# Altium schematic sheet MCU.SchDoc
size B; SheetNumber: 1; SheetTotal: 7
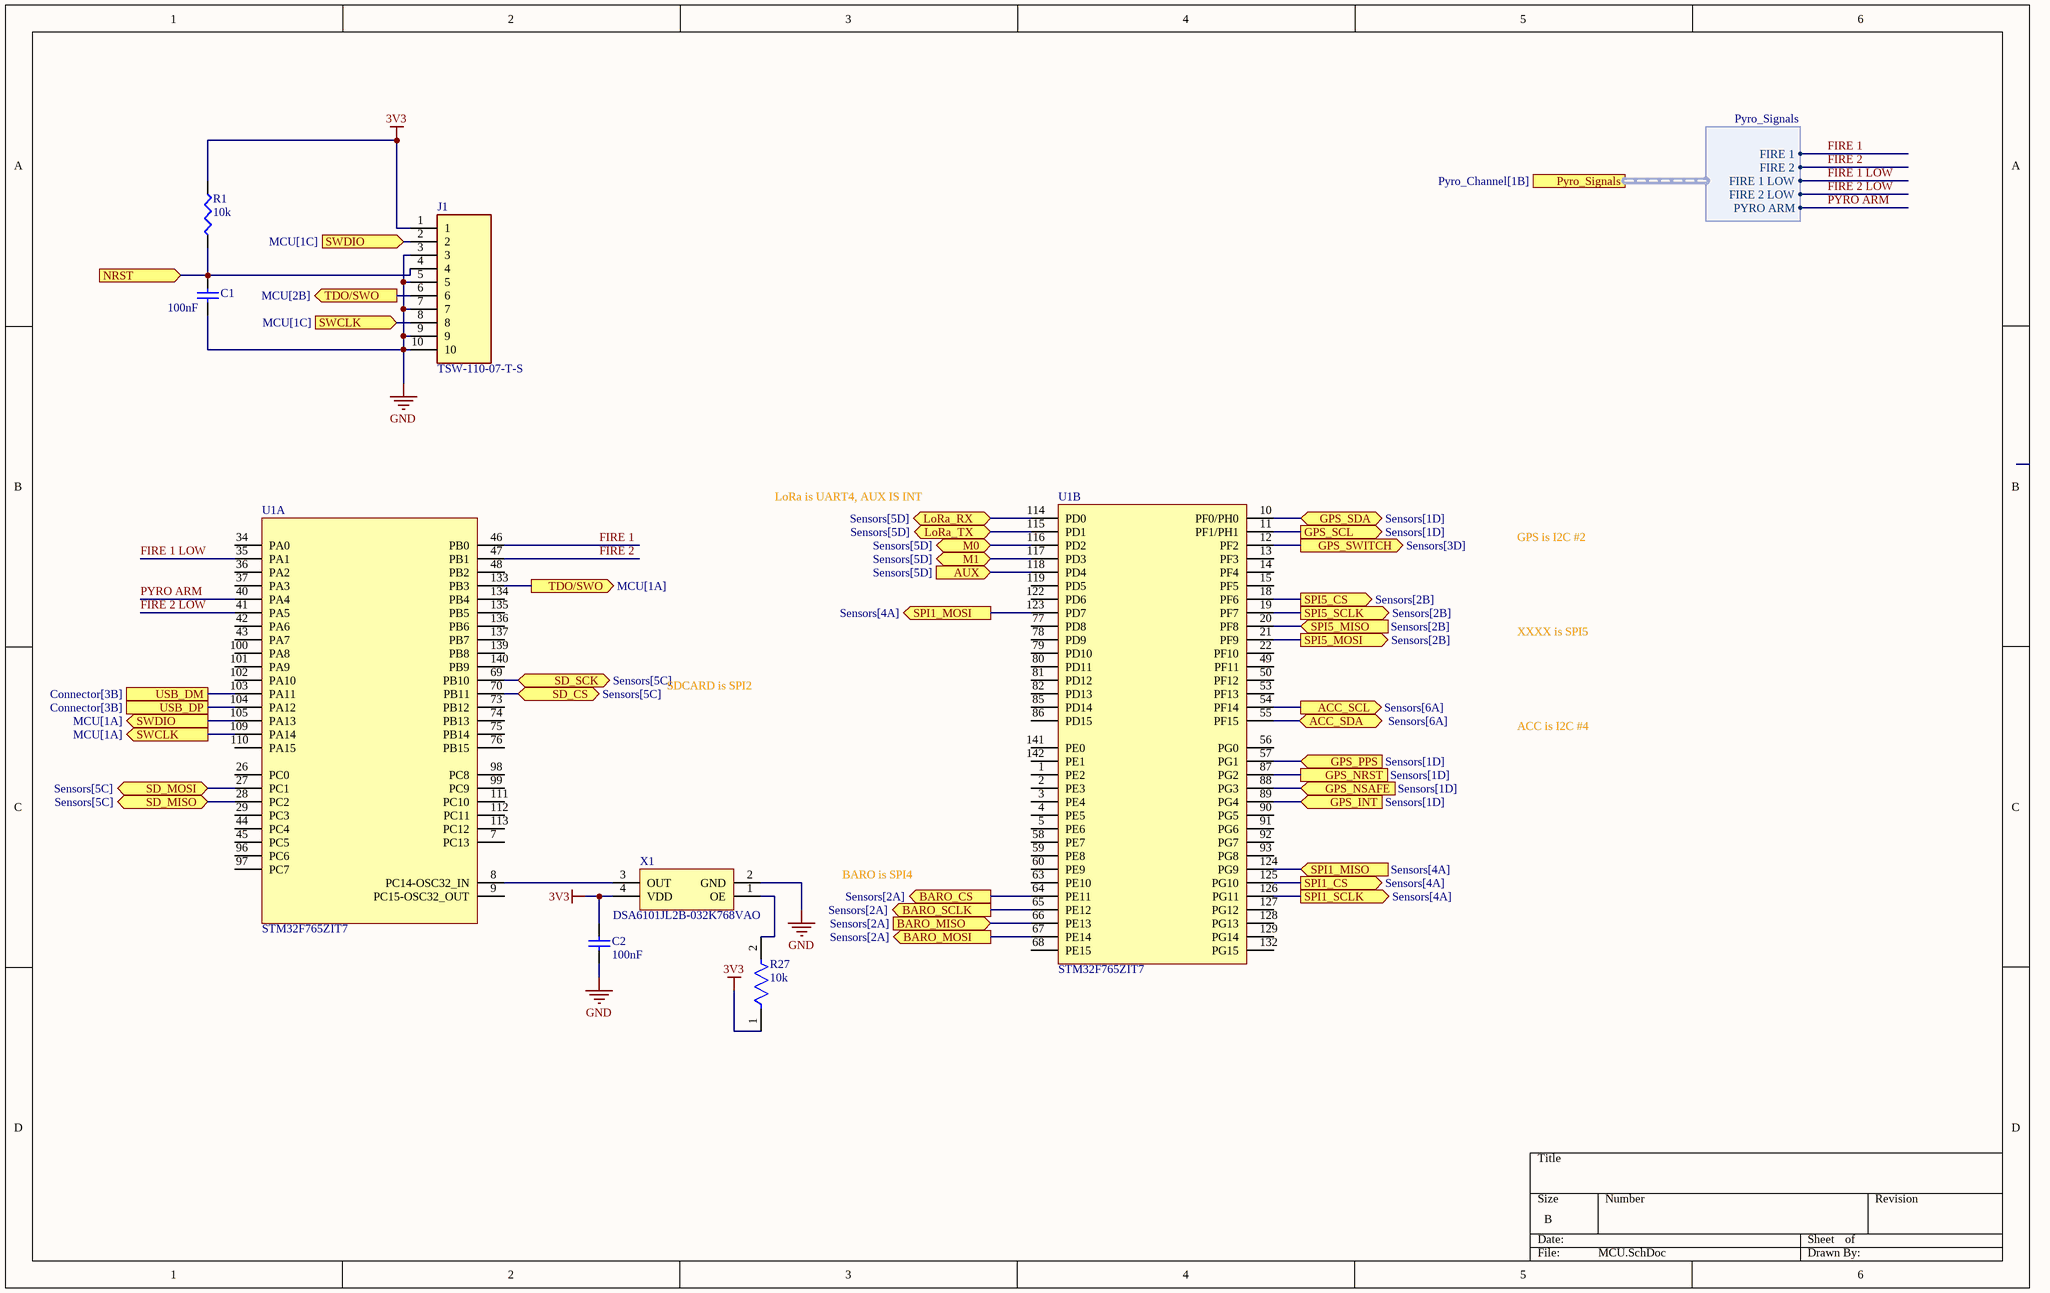
[diagram p0: MCU.SchDoc]

## Parts
C1  100nF  [0402_C]
C2  100nF  [0402_C]
J1  TSW-110-07-T-S  [TSW-110-XX-YY-S]
R1  10k  [0402_R]
R27  10k  [FP-AC0805-0_6-MFG]
U1  STM32F765ZIT7  [QFP50P2200X2200X160-144N]  (parts A,B of 3)
X1  DSA6101JL2B-032K768VAO  [VLGA4_AUA_MCH]

## Ports
ACC_SCL (out, see Sensors[6A]), ACC_SDA (bidir, see Sensors[6A]), AUX (in, see Sensors[5D]), BARO_CS (out, see Sensors[2A]), BARO_MISO (in, see Sensors[2A]), BARO_MOSI (out, see Sensors[2A]), BARO_SCLK (out, see Sensors[2A]), GPS_INT (in, see Sensors[1D]), GPS_NRST (see Sensors[1D]), GPS_NSAFE (in, see Sensors[1D]), GPS_PPS (in, see Sensors[1D]), GPS_SCL (out, see Sensors[1D]), GPS_SDA (bidir, see Sensors[1D]), GPS_SWITCH (out, see Sensors[3D]), LoRa_RX (bidir, see Sensors[5D]), LoRa_TX (bidir, see Sensors[5D]), M0 (bidir, see Sensors[5D]), M1 (bidir, see Sensors[5D]), NRST (in), Pyro_Signals (harness Pyro_Signals, see Pyro_Channel[1B]), SD_CS (bidir, see Sensors[5C]), SD_MISO (bidir, see Sensors[5C]), SD_MOSI (bidir, see Sensors[5C]), SD_SCK (bidir, see Sensors[5C]), SPI1_CS (out, see Sensors[4A]), SPI1_MISO (in, see Sensors[4A]), SPI1_MOSI (out, see Sensors[4A]), SPI1_SCLK (out, see Sensors[4A]), SPI5_CS (out, see Sensors[2B]), SPI5_MISO (in, see Sensors[2B]), SPI5_MOSI (out, see Sensors[2B]), SPI5_SCLK (out, see Sensors[2B]), SWCLK (in, see MCU[1C]), SWCLK (out, see MCU[1A]), SWDIO (in, see MCU[1C]), SWDIO (out, see MCU[1A]), TDO/SWO (out, see MCU[1A]), TDO/SWO (out, see MCU[2B]), USB_DM (see Connector[3B]), USB_DP (see Connector[3B])

## Harnesses
Pyro_Signals: FIRE 1, FIRE 2, FIRE 1 LOW, PYRO ARM, FIRE 2 LOW

## Nets
3V3: C2.1 J1.1 R1.2 R27.1 X1.4(VDD)
GND: C1.1 C2.2 J1.3 J1.5 J1.7 J1.9 J1.10 X1.2(GND)
ACC_SCL: U1.54(PF14) ; port ACC_SCL
ACC_SDA: U1.55(PF15) ; port ACC_SDA
AUX: U1.118(PD4) ; port AUX
BARO_CS: U1.64(PE11) ; port BARO_CS
BARO_MISO: U1.66(PE13) ; port BARO_MISO
BARO_MOSI: U1.67(PE14) ; port BARO_MOSI
BARO_SCLK: U1.65(PE12) ; port BARO_SCLK
FIRE 1: U1.46(PB0) ; port Pyro_Signals.FIRE 1
FIRE 1 LOW: U1.35(PA1) ; port Pyro_Signals.FIRE 1 LOW
FIRE 2: U1.47(PB1) ; port Pyro_Signals.FIRE 2
FIRE 2 LOW: U1.41(PA5) ; port Pyro_Signals.FIRE 2 LOW
GPS_INT: U1.89(PG4) ; port GPS_INT
GPS_NRST: U1.87(PG2) ; port GPS_NRST
GPS_NSAFE: U1.88(PG3) ; port GPS_NSAFE
GPS_PPS: U1.57(PG1) ; port GPS_PPS
GPS_SCL: U1.11(PF1/PH1) ; port GPS_SCL
GPS_SDA: U1.10(PF0/PH0) ; port GPS_SDA
GPS_SWITCH: U1.12(PF2) ; port GPS_SWITCH
LoRa_RX: U1.114(PD0) ; port LoRa_RX
LoRa_TX: U1.115(PD1) ; port LoRa_TX
M0: U1.116(PD2) ; port M0
M1: U1.117(PD3) ; port M1
NRST: C1.2 J1.4 R1.1 ; port NRST
PYRO ARM: U1.40(PA4) ; port Pyro_Signals.PYRO ARM
SD_CS: U1.70(PB11) ; port SD_CS
SD_MISO: U1.28(PC2) ; port SD_MISO
SD_MOSI: U1.27(PC1) ; port SD_MOSI
SD_SCK: U1.69(PB10) ; port SD_SCK
SPI1_CS: U1.125(PG10) ; port SPI1_CS
SPI1_MISO: U1.124(PG9) ; port SPI1_MISO
SPI1_MOSI: U1.123(PD7) ; port SPI1_MOSI
SPI1_SCLK: U1.126(PG11) ; port SPI1_SCLK
SPI5_CS: U1.18(PF6) ; port SPI5_CS
SPI5_MISO: U1.20(PF8) ; port SPI5_MISO
SPI5_MOSI: U1.21(PF9) ; port SPI5_MOSI
SPI5_SCLK: U1.19(PF7) ; port SPI5_SCLK
SWCLK: J1.8 U1.109(PA14) ; port SWCLK
SWDIO: J1.2 U1.105(PA13) ; port SWDIO
TDO/SWO: J1.6 U1.133(PB3) ; port TDO/SWO
USB_DM: U1.103(PA11) ; port USB_DM
USB_DP: U1.104(PA12) ; port USB_DP
NetR27_2: R27.2 X1.1(OE)
NetU1_8: U1.8(PC14-OSC32_IN) X1.3(OUT)

Not connected (* = marked no-connect by the designer): U1 1(PE2) 2(PE3) 3(PE4) 4(PE5) 5(PE6) 7(PC13) 9(PC15-OSC32_OUT) 13(PF3) 14(PF4) 15(PF5) 22(PF10) 26(PC0) 29(PC3) 34(PA0) 36(PA2) 37(PA3) 42(PA6) 43(PA7) 44(PC4) 45(PC5) 48(PB2) 49(PF11) 50(PF12) 53(PF13) 56(PG0) 58(PE7) 59(PE8) 60(PE9) 63(PE10) 68(PE15) 73(PB12) 74(PB13) 75(PB14) 76(PB15) 77(PD8) 78(PD9) 79(PD10) 80(PD11) 81(PD12) 82(PD13) 85(PD14) 86(PD15) 90(PG5) 91(PG6) 92(PG7) 93(PG8) 96(PC6) 97(PC7) 98(PC8) 99(PC9) 100(PA8) 101(PA9) 102(PA10) 110(PA15) 111(PC10) 112(PC11) 113(PC12) 119(PD5) 122(PD6) 127(PG12) 128(PG13) 129(PG14) 132(PG15) 134(PB4) 135(PB5) 136(PB6) 137(PB7) 139(PB8) 140(PB9) 141(PE0) 142(PE1)

## Notes on the sheet
- LoRa is UART4, AUX IS INT
- GPS is I2C #2
- XXXX is SPI5
- SDCARD is SPI2
- ACC is I2C #4
- BARO is SPI4

## Library data of the parts
C1 C2 = C_100nF_0402: Ceramic Capacitor, Multilayer, Ceramic, 16V, 10% +Tol, 10% -Tol, X7R, +-15% TC, 100nF, Surface Mount, 0402 inch; Manufacturer: Samsung Electro-Mechanics; Manufacturer Part Number: CL05B104KO5NNNC; Supplier: DigiKey; Supplier Part Number: 1276-1001-1-ND; RoHS: Compliant; Category: Ceramic Capacitors; Stock: 253470; Pricing: 1=0.08, 10=0.009, 50=0.0076, 100=0.0064, 500=0.0056, 1000=0.004, 2500=0.00394 (USD); Value: 100nF; Case/Package: 0402; Case Code (Imperial): 0402; Case Code (Metric): 1005; China RoHS: Compliant; Contact Plating: Tin; Depth: 500µm; Dielectric: X7R; Dielectric Material: Ceramic; Height: 500µm; Lead Free: Lead Free; Length: 1mm; Lifecycle Status: Production; Material: Ceramic; Max Operating Temperature: 125°C; Min Operating Temperature: -55°C; Mounting Technology: Surface Mount; Number of Terminals: 2; Radiation Hardening: No; REACH SVHC: Yes; Schedule B: 8532240020, 8532240020|8532240020|8532240020|8532240020|8532240020|8532240020|8532240020|8532240020|8532240020|8532240020|8532240020|8532240020|8532240020|8532240020|8532240020|8532240020|8532240020|8532240020|8532240020|8532240020|8532240020|8532240020|8532240020|85; Thickness: 558.8µm; Tolerance: 10%; Voltage: 16V; Voltage Rating: 16V; Voltage Rating (DC): 16V; Width: 500µm; ComponentLink1URL: https://datasheet.octopart.com:443/CL05B104KO5NNNC-Samsung-Electro-Mechanics-datasheet-181960518.pdf?src-supplier=IHS; ComponentLink1Description: https://datasheet.octopart.com:443/CL05B104KO5NNNC-Samsung-Electro-Mechanics-datasheet-181960518.pdf?src-supplier=IHS; ComponentLink2URL: https://datasheet.octopart.com:443/CL05B104KO5NNNC-Samsung-Electro-Mechanics-datasheet-81461623.pdf?src-supplier=Upverter; ComponentLink2Description: https://datasheet.octopart.com:443/CL05B104KO5NNNC-Samsung-Electro-Mechanics-datasheet-81461623.pdf?src-supplier=Upverter; ComponentLink3URL: https://datasheet.octopart.com/CL05B104KO5NNNC-Samsung-Electro-Mechanics-datasheet-8324245.pdf; ComponentLink3Description: https://datasheet.octopart.com/CL05B104KO5NNNC-Samsung-Electro-Mechanics-datasheet-8324245.pdf; ComponentLink4URL: https://datasheet.octopart.com/CL05B104KO5NNNC-Samsung-Electro-Mechanics-datasheet-97040617.pdf; ComponentLink4Description: https://datasheet.octopart.com/CL05B104KO5NNNC-Samsung-Electro-Mechanics-datasheet-97040617.pdf; ComponentLink5URL: https://datasheet.octopart.com/General-Multilayer-Ceramic-Capacitors-Samsung-datasheet-family-111.pdf; ComponentLink5Description: https://datasheet.octopart.com/General-Multilayer-Ceramic-Capacitors-Samsung-datasheet-family-111.pdf; ComponentLink6URL: https://datasheet.octopart.com:443/CL05B104KO5NNNC-Samsung-Electro-Mechanics-datasheet-141346863.pdf?src-supplier=Samsung+SCT; ComponentLink6Description: https://datasheet.octopart.com:443/CL05B104KO5NNNC-Samsung-Electro-Mechanics-datasheet-141346863.pdf?src-supplier=Samsung+SCT; ComponentLink7URL: https://datasheet.octopart.com:443/CL05B104KO5NNNC-Samsung-datasheet-151956582.pdf?src-supplier=SOS+electronic; ComponentLink7Description: https://datasheet.octopart.com:443/CL05B104KO5NNNC-Samsung-datasheet-151956582.pdf?src-supplier=SOS+electronic; ComponentLink8URL: https://datasheet.octopart.com:443/CL05B104KO5NNNC-Samsung-datasheet-42485123.pdf?src-supplier=Future+Electronics; ComponentLink8Description: https://datasheet.octopart.com:443/CL05B104KO5NNNC-Samsung-datasheet-42485123.pdf?src-supplier=Future+Electronics; ComponentLink9URL: https://datasheet.octopart.com:443/CL05B104KO5NNNC-Samsung-datasheet-34153835.pdf?src-supplier=Future+Electronics; ComponentLink9Description: https://datasheet.octopart.com:443/CL05B104KO5NNNC-Samsung-datasheet-34153835.pdf?src-supplier=Future+Electronics; ComponentLink10URL: https://datasheet.octopart.com:443/CL05B104KO5NNNC-Samsung-datasheet-26589024.pdf?src-supplier=Future+Electronics; ComponentLink10Description: https://datasheet.octopart.com:443/CL05B104KO5NNNC-Samsung-datasheet-26589024.pdf?src-supplier=Future+Electronics; ComponentLink11URL: https://datasheet.octopart.com:443/CL05B104KO5NNNC-Samsung-Electro-Mechanics-datasheet-149136714.pdf?src-supplier=Future+Electronics; ComponentLink11Description: https://datasheet.octopart.com:443/CL05B104KO5NNNC-Samsung-Electro-Mechanics-datasheet-149136714.pdf?src-supplier=Future+Electronics; ComponentLink12URL: https://datasheet.octopart.com:443/CL05B104KO5NNNC-Samsung-datasheet-59220082.pdf?src-supplier=TME; ComponentLink12Description: https://datasheet.octopart.com:443/CL05B104KO5NNNC-Samsung-datasheet-59220082.pdf?src-supplier=TME; ComponentLink13URL: http://sigma.octopart.com:80/rohs_certificate/General-Multilayer-Ceramic-Capacitors-Samsung-family-110.pdf?src-supplier=Compliance+Statements; ComponentLink13Description: http://sigma.octopart.com:80/rohs_certificate/General-Multilayer-Ceramic-Capacitors-Samsung-family-110.pdf?src-supplier=Compliance+Statements; ComponentLink14URL: http://sigma.octopart.com:80/rohs_statement/General-Multilayer-Ceramic-Capacitors-Samsung-family-132.pdf?src-supplier=Compliance+Statements; ComponentLink14Description: http://sigma.octopart.com:80/rohs_statement/General-Multilayer-Ceramic-Capacitors-Samsung-family-132.pdf?src-supplier=Compliance+Statements; ComponentLink15URL: http://sigma.octopart.com:80/reach_statement/General-Multilayer-Ceramic-Capacitors-Samsung-family-133.pdf?src-supplier=Compliance+Statements; ComponentLink15Description: http://sigma.octopart.com:80/reach_statement/General-Multilayer-Ceramic-Capacitors-Samsung-family-133.pdf?src-supplier=Compliance+Statements; LCSC Part #: C1525
J1 = TSW-110-07-T-S: CONN HEADER VERT 10POS 2.54MM; Manufacturer_Name: SAMTEC; Manufacturer Lifecycle Status: PRODUCTION; Connector Type: Male Pin; Gender: Male; Max Current Rating: 7.6A; Max Voltage Rating (AC): 550V; Number of Contacts: 10; Datasheet Link: https://www.samtec.com/partnumber/TSW-110-07-T-S; Manufacturer_Part_Number: TSW-110-07-T-S; Mouser Part Number: 200-TSW11007TS; Mouser Price/Stock: https://www.mouser.co.uk/ProductDetail/Samtec/TSW-110-07-T-S?qs=rU5fayqh%252BE03fU8gEqe7bw%3D%3D; Arrow Part Number: TSW-110-07-T-S; Arrow Price/Stock: https://www.arrow.com/en/products/tsw-110-07-t-s/samtec?region=nac; Supplier: DigiKey; Supplier Part Number: SAM1035-10-ND; Manufacturer: Samtec; Manufacturer Part Number: TSW-110-07-T-S; RoHS: Compliant; Category: Headers and Wire Housings; Stock: 1480; Pricing: 1=0.76, 10=0.645, 100=0.5476, 500=0.48878, 1000=0.46544, 5000=0.43876 (USD); Color: Black; Contact Material: Nickel, Tin; Contact Mating Length: 5.842mm; Contact Plating: Tin; Depth: 2.54mm; Height: 8.71mm; Housing Color: Black; Housing Material: Polyester; Lead Free: Lead Free; Lead Pitch: 2.54mm; Length: 25.4mm; Lifecycle Status: Production; Max Operating Temperature: 105°C; Min Operating Temperature: -55°C; Mounting Technology: Through Hole; Pins: 10; Number of Positions: 10; Number of Rows: 1; Orientation: Straight; Packaging: Bulk; Pitch: 2.54mm; Radiation Hardening: No; REACH SVHC: No; Termination: Solder; Width: 2.54mm; ComponentLink1URL: https://datasheet.octopart.com:443/TSW-110-07-T-S-Samtec-datasheet-151455181.pdf?src-supplier=Upverter; ComponentLink1Description: https://datasheet.octopart.com:443/TSW-110-07-T-S-Samtec-datasheet-151455181.pdf?src-supplier=Upverter; ComponentLink2URL: https://sigma.octopart.com:443/14433679/technical_drawing/Samtec-TSW-110-07-T-S.pdf?src-supplier=Upverter; ComponentLink2Description: https://sigma.octopart.com:443/14433679/technical_drawing/Samtec-TSW-110-07-T-S.pdf?src-supplier=Upverter; ComponentLink3URL: https://datasheet.octopart.com:443/TSW-110-07-T-S-Samtec-datasheet-97325576.pdf?src-supplier=Sager+Electronics; ComponentLink3Description: https://datasheet.octopart.com:443/TSW-110-07-T-S-Samtec-datasheet-97325576.pdf?src-supplier=Sager+Electronics; ComponentLink4URL: https://sigma.octopart.com:443/97325577/technical_drawing/Samtec-TSW-110-07-T-S.pdf?src-supplier=Samtec; ComponentLink4Description: https://sigma.octopart.com:443/97325577/technical_drawing/Samtec-TSW-110-07-T-S.pdf?src-supplier=Samtec; ComponentLink5URL: https://datasheet.octopart.com:443/TSW-110-07-T-S-Samtec-datasheet-62107121.pdf?src-supplier=element14+APAC; ComponentLink5Description: https://datasheet.octopart.com:443/TSW-110-07-T-S-Samtec-datasheet-62107121.pdf?src-supplier=element14+APAC; ComponentLink6URL: https://datasheet.octopart.com:443/TSW-110-07-T-S-Samtec-datasheet-136646178.pdf?src-supplier=Master+Electronics; ComponentLink6Description: https://datasheet.octopart.com:443/TSW-110-07-T-S-Samtec-datasheet-136646178.pdf?src-supplier=Master+Electronics; ComponentLink7URL: https://datasheet.octopart.com:443/TSW-110-07-T-S-Samtec-datasheet-118235302.pdf?src-supplier=Electro+Sonic; ComponentLink7Description: https://datasheet.octopart.com:443/TSW-110-07-T-S-Samtec-datasheet-118235302.pdf?src-supplier=Electro+Sonic; ComponentLink8URL: https://datasheet.octopart.com:443/TSW-110-07-T-S-Samtec-datasheet-180258786.pdf?src-supplier=JRH+Electronics; ComponentLink8Description: https://datasheet.octopart.com:443/TSW-110-07-T-S-Samtec-datasheet-180258786.pdf?src-supplier=JRH+Electronics; ComponentLink9URL: https://datasheet.octopart.com:443/TSW-110-07-T-S-Samtec-datasheet-164324425.pdf?src-supplier=Newark; ComponentLink9Description: https://datasheet.octopart.com:443/TSW-110-07-T-S-Samtec-datasheet-164324425.pdf?src-supplier=Newark; ComponentLink10URL: https://datasheet.octopart.com:443/TSW-110-07-T-S-Samtec-datasheet-11047283.pdf?src-supplier=Newark; ComponentLink10Description: https://datasheet.octopart.com:443/TSW-110-07-T-S-Samtec-datasheet-11047283.pdf?src-supplier=Newark; ComponentLink11URL: https://datasheet.octopart.com:443/TSW-110-07-T-S-Samtec-datasheet-160657603.pdf?src-supplier=Toby+Electronics; ComponentLink11Description: https://datasheet.octopart.com:443/TSW-110-07-T-S-Samtec-datasheet-160657603.pdf?src-supplier=Toby+Electronics; ComponentLink12URL: https://datasheet.octopart.com:443/TSW-110-07-T-S-Samtec-datasheet-116539033.pdf?src-supplier=Toby+Electronics; ComponentLink12Description: https://datasheet.octopart.com:443/TSW-110-07-T-S-Samtec-datasheet-116539033.pdf?src-supplier=Toby+Electronics; ComponentLink13URL: https://datasheet.octopart.com:443/TSW-110-07-T-S-Samtec-datasheet-116536310.pdf?src-supplier=Toby+Electronics; ComponentLink13Description: https://datasheet.octopart.com:443/TSW-110-07-T-S-Samtec-datasheet-116536310.pdf?src-supplier=Toby+Electronics; ComponentLink14URL: https://datasheet.octopart.com/TSW-110-07-T-S-Samtec-datasheet-86818365.pdf; ComponentLink14Description: https://datasheet.octopart.com/TSW-110-07-T-S-Samtec-datasheet-86818365.pdf; ComponentLink15URL: https://datasheet.octopart.com:443/TSW-110-07-T-S-Samtec-datasheet-11542832.pdf?src-supplier=Arrow+Electronics; ComponentLink15Description: https://datasheet.octopart.com:443/TSW-110-07-T-S-Samtec-datasheet-11542832.pdf?src-supplier=Arrow+Electronics; ComponentLink16URL: https://datasheet.octopart.com:443/TSW-110-07-T-S-Samtec-datasheet-5313500.pdf?src-supplier=_legacy+Avnet; ComponentLink16Description: https://datasheet.octopart.com:443/TSW-110-07-T-S-Samtec-datasheet-5313500.pdf?src-supplier=_legacy+Avnet; LCSC Part #: C7128266
R1 = R_10k_0402: RES SMD 10K OHM 0.1% 1/16W 0402; Manufacturer: Yageo Group; Manufacturer Part Number: RC0402FR-071KL; Power Dissipation: 62.5mW; Power Rating: 63mW; Value: 10kΩ; Temperature Coefficient: 100ppm/°C; Tolerance: 1%; Voltage Rating: 50V; LCSC Part #: C191915; Supplier: DigiKey; Supplier Part Number: 311-1.00KLRTR-ND; RoHS: Compliant; Category: Chip SMD Resistors; Stock: 4926888; Pricing: 10000=0.00204, 20000=0.002, 30000=0.00196, 50000=0.00182, 70000=0.00181 (USD); Case/Package: 0402; Case Code (Imperial): 0402; Case Code (Metric): 0402; China RoHS: Non-Compliant; Composition: Thick Film; Depth: 500µm; Height: 350µm; Lead Free: Lead Free; Length: 1mm; Lifecycle Status: Production; Max Operating Temperature: 155°C; Military Standard: Not; Min Operating Temperature: -55°C; Mounting Technology: Surface Mount; Pins: 2; Number of Terminals: 2; Packaging: Tape & Reel; REACH SVHC: Yes; Schedule B: 8533210045, 8533210045|8533210045|8533210045|8533210045|8533210045|8533210045|8533210045|8533210045|8533210045|8533210045|8533210045|8533210045|8533210045|8533210045|8533210045|8533210045|8533210045|8533210045|8533210045|8533210045|8533210045|8533210045|8533210045|85; Termination: SMD/SMT; Voltage Rating (AC): 50V; Voltage Rating (DC): 50V; Width: 500µm; Working Voltage: 50V; ComponentLink1URL: https://datasheet.octopart.com:443/RC0402FR-071KL-Yageo-datasheet-175887523.pdf?src-supplier=IHS; ComponentLink1Description: https://datasheet.octopart.com:443/RC0402FR-071KL-Yageo-datasheet-175887523.pdf?src-supplier=IHS; ComponentLink2URL: https://datasheet.octopart.com:443/RC0402FR-071KL-Yageo-datasheet-164759695.pdf?src-supplier=Upverter; ComponentLink2Description: https://datasheet.octopart.com:443/RC0402FR-071KL-Yageo-datasheet-164759695.pdf?src-supplier=Upverter; ComponentLink3URL: https://datasheet.octopart.com:443/RC0402FR-071KL-Yageo-datasheet-103092701.pdf?src-supplier=Upverter; ComponentLink3Description: https://datasheet.octopart.com:443/RC0402FR-071KL-Yageo-datasheet-103092701.pdf?src-supplier=Upverter; ComponentLink4URL: https://sigma.octopart.com:443/138820526/technical_drawing/Yageo-RC0402FR-071KL.pdf?src-supplier=Upverter; ComponentLink4Description: https://sigma.octopart.com:443/138820526/technical_drawing/Yageo-RC0402FR-071KL.pdf?src-supplier=Upverter; ComponentLink5URL: https://datasheet.octopart.com:443/RC0402FR-071KL-Yageo-datasheet-98239111.pdf?src-supplier=Upverter; ComponentLink5Description: https://datasheet.octopart.com:443/RC0402FR-071KL-Yageo-datasheet-98239111.pdf?src-supplier=Upverter; ComponentLink6URL: https://datasheet.octopart.com:443/RC0402FR-071KL-Yageo-datasheet-10408619.pdf?src-supplier=Newark; ComponentLink6Description: https://datasheet.octopart.com:443/RC0402FR-071KL-Yageo-datasheet-10408619.pdf?src-supplier=Newark; ComponentLink7URL: https://datasheet.octopart.com:443/RC0402FR-071KL-Yageo-datasheet-8324527.pdf?src-supplier=Newark; ComponentLink7Description: https://datasheet.octopart.com:443/RC0402FR-071KL-Yageo-datasheet-8324527.pdf?src-supplier=Newark; ComponentLink8URL: https://datasheet.octopart.com:443/RC0402FR-071KL-Yageo-datasheet-62067350.pdf?src-supplier=Farnell; ComponentLink8Description: https://datasheet.octopart.com:443/RC0402FR-071KL-Yageo-datasheet-62067350.pdf?src-supplier=Farnell; ComponentLink9URL: https://datasheet.octopart.com:443/RC0402FR-071KL-Yageo-datasheet-12531192.pdf?src-supplier=Future+Electronics; ComponentLink9Description: https://datasheet.octopart.com:443/RC0402FR-071KL-Yageo-datasheet-12531192.pdf?src-supplier=Future+Electronics; ComponentLink10URL: https://datasheet.octopart.com:443/RC0402FR-071KL-Yageo-datasheet-137700087.pdf?src-supplier=Future+Electronics; ComponentLink10Description: https://datasheet.octopart.com:443/RC0402FR-071KL-Yageo-datasheet-137700087.pdf?src-supplier=Future+Electronics; ComponentLink11URL: https://datasheet.octopart.com:443/RC0402FR-071KL-Yageo-datasheet-8324255.pdf?src-supplier=Future+Electronics; ComponentLink11Description: https://datasheet.octopart.com:443/RC0402FR-071KL-Yageo-datasheet-8324255.pdf?src-supplier=Future+Electronics; ComponentLink12URL: https://datasheet.octopart.com:443/RC0402FR-071KL-Yageo-datasheet-8329306.pdf?src-supplier=element14; ComponentLink12Description: https://datasheet.octopart.com:443/RC0402FR-071KL-Yageo-datasheet-8329306.pdf?src-supplier=element14; ComponentLink13URL: https://datasheet.octopart.com:443/RC0402FR-071KL-Yageo-datasheet-505231.pdf?src-supplier=element14; ComponentLink13Description: https://datasheet.octopart.com:443/RC0402FR-071KL-Yageo-datasheet-505231.pdf?src-supplier=element14; ComponentLink14URL: https://datasheet.octopart.com:443/RC0402FR-071KL-Yageo-datasheet-175423674.pdf?src-supplier=SOS+electronic; ComponentLink14Description: https://datasheet.octopart.com:443/RC0402FR-071KL-Yageo-datasheet-175423674.pdf?src-supplier=SOS+electronic; ComponentLink15URL: https://datasheet.octopart.com:443/RC0402FR-071KL-Yageo-datasheet-148775077.pdf?src-supplier=TME; ComponentLink15Description: https://datasheet.octopart.com:443/RC0402FR-071KL-Yageo-datasheet-148775077.pdf?src-supplier=TME; ComponentLink16URL: https://datasheet.octopart.com:443/RC0402FR-071KL-Yageo-datasheet-79472498.pdf?src-supplier=Megastar; ComponentLink16Description: https://datasheet.octopart.com:443/RC0402FR-071KL-Yageo-datasheet-79472498.pdf?src-supplier=Megastar; ComponentLink17URL: https://datasheet.octopart.com/RC0402FR-071KL-Yageo-datasheet-73766026.pdf; ComponentLink17Description: https://datasheet.octopart.com/RC0402FR-071KL-Yageo-datasheet-73766026.pdf; ComponentLink18URL: http://sigma.octopart.com:80/rohs_statement/Yageo-company-2.pdf?src-supplier=Compliance+Statements; ComponentLink18Description: http://sigma.octopart.com:80/rohs_statement/Yageo-company-2.pdf?src-supplier=Compliance+Statements; ComponentLink19URL: http://sigma.octopart.com:80/conflict_mineral_statement/Yageo-company-3.pdf?src-supplier=Compliance+Statements; ComponentLink19Description: http://sigma.octopart.com:80/conflict_mineral_statement/Yageo-company-3.pdf?src-supplier=Compliance+Statements; Contact Plating: Tin; Features: Automotive AEC-Q200; Max Power Dissipation: 63mW; Number of Terminations: 2; Radiation Hardening: No; ComponentLink20URL: https://sigma.octopart.com:443/138766958/technical_drawing/Panasonic-ERA-2AEB103X.pdf?src-supplier=Upverter; ComponentLink20Description: https://sigma.octopart.com:443/138766958/technical_drawing/Panasonic-ERA-2AEB103X.pdf?src-supplier=Upverter; ComponentLink21URL: https://datasheet.octopart.com:443/ERA-2AEB103X-Panasonic-datasheet-62287448.pdf?src-supplier=Future+Electronics; ComponentLink21Description: https://datasheet.octopart.com:443/ERA-2AEB103X-Panasonic-datasheet-62287448.pdf?src-supplier=Future+Electronics; ComponentLink22URL: https://datasheet.octopart.com:443/ERA-2AEB103X-Panasonic-datasheet-12510007.pdf?src-supplier=Future+Electronics; ComponentLink22Description: https://datasheet.octopart.com:443/ERA-2AEB103X-Panasonic-datasheet-12510007.pdf?src-supplier=Future+Electronics; ComponentLink23URL: https://datasheet.octopart.com:443/ERA-2AEB103X-Panasonic-datasheet-11763931.pdf?src-supplier=Future+Electronics; ComponentLink23Description: https://datasheet.octopart.com:443/ERA-2AEB103X-Panasonic-datasheet-11763931.pdf?src-supplier=Future+Electronics; ComponentLink24URL: https://datasheet.octopart.com:443/ERA-2AEB103X-Panasonic-datasheet-10840895.pdf?src-supplier=Future+Electronics; ComponentLink24Description: https://datasheet.octopart.com:443/ERA-2AEB103X-Panasonic-datasheet-10840895.pdf?src-supplier=Future+Electronics; ComponentLink25URL: https://datasheet.octopart.com:443/ERA-2AEB103X-Panasonic-datasheet-8367715.pdf?src-supplier=Future+Electronics; ComponentLink25Description: https://datasheet.octopart.com:443/ERA-2AEB103X-Panasonic-datasheet-8367715.pdf?src-supplier=Future+Electronics; ComponentLink26URL: https://datasheet.octopart.com:443/ERA-2AEB103X-Panasonic-datasheet-5392808.pdf?src-supplier=Future+Electronics; ComponentLink26Description: https://datasheet.octopart.com:443/ERA-2AEB103X-Panasonic-datasheet-5392808.pdf?src-supplier=Future+Electronics; ComponentLink27URL: https://datasheet.octopart.com:443/ERA-2AEB103X-Panasonic-datasheet-136531316.pdf?src-supplier=TME; ComponentLink27Description: https://datasheet.octopart.com:443/ERA-2AEB103X-Panasonic-datasheet-136531316.pdf?src-supplier=TME; ComponentLink28URL: https://datasheet.octopart.com:443/ERA2AEB103X-Panasonic-datasheet-188913046.pdf?src-supplier=TME; ComponentLink28Description: https://datasheet.octopart.com:443/ERA2AEB103X-Panasonic-datasheet-188913046.pdf?src-supplier=TME; ComponentLink29URL: https://datasheet.octopart.com:443/ERA-2AEB103X-Panasonic-datasheet-13266200.pdf?src-supplier=_legacy+Avnet; ComponentLink29Description: https://datasheet.octopart.com:443/ERA-2AEB103X-Panasonic-datasheet-13266200.pdf?src-supplier=_legacy+Avnet; ComponentLink30URL: https://datasheet.octopart.com:443/ERA2AEB103X-Panasonic-datasheet-5311861.pdf?src-supplier=Newark; ComponentLink30Description: https://datasheet.octopart.com:443/ERA2AEB103X-Panasonic-datasheet-5311861.pdf?src-supplier=Newark; ComponentLink31URL: https://datasheet.octopart.com:443/ERA-2AEB103X-Panasonic-datasheet-61114971.pdf?src-supplier=Newark; ComponentLink31Description: https://datasheet.octopart.com:443/ERA-2AEB103X-Panasonic-datasheet-61114971.pdf?src-supplier=Newark; ComponentLink32URL: https://datasheet.octopart.com:443/ERA-2AEB103X-Panasonic-datasheet-34200419.pdf?src-supplier=Newark; ComponentLink32Description: https://datasheet.octopart.com:443/ERA-2AEB103X-Panasonic-datasheet-34200419.pdf?src-supplier=Newark; ComponentLink33URL: https://datasheet.octopart.com:443/ERA-2AEB103X-Panasonic-datasheet-7542722.pdf?src-supplier=element14+APAC; ComponentLink33Description: https://datasheet.octopart.com:443/ERA-2AEB103X-Panasonic-datasheet-7542722.pdf?src-supplier=element14+APAC; ComponentLink34URL: https://datasheet.octopart.com:443/ERA-2AEB103X-Panasonic-datasheet-154766165.pdf?src-supplier=Master+Electronics; ComponentLink34Description: https://datasheet.octopart.com:443/ERA-2AEB103X-Panasonic-datasheet-154766165.pdf?src-supplier=Master+Electronics; ComponentLink35URL: https://datasheet.octopart.com:443/ERA-2AEB103X-Panasonic-datasheet-46744048.pdf?src-supplier=RS+(Formerly+Allied+Electronics); ComponentLink35Description: https://datasheet.octopart.com:443/ERA-2AEB103X-Panasonic-datasheet-46744048.pdf?src-supplier=RS+(Formerly+Allied+Electronics); ComponentLink36URL: https://sigma.octopart.com:443/150570796/technical_drawing/Panasonic-ERA2AEB103X.pdf?src-supplier=Panasonic+SCT; ComponentLink36Description: https://sigma.octopart.com:443/150570796/technical_drawing/Panasonic-ERA2AEB103X.pdf?src-supplier=Panasonic+SCT; ComponentLink37URL: https://datasheet.octopart.com/ERA-2AEB103X-Panasonic-datasheet-78375410.pdf; ComponentLink37Description: https://datasheet.octopart.com/ERA-2AEB103X-Panasonic-datasheet-78375410.pdf; ComponentLink38URL: https://datasheet.octopart.com:443/ERA2AEB103X-Panasonic---ECG-datasheet-15994758.pdf?src-supplier=Farnell; ComponentLink38Description: https://datasheet.octopart.com:443/ERA2AEB103X-Panasonic---ECG-datasheet-15994758.pdf?src-supplier=Farnell; ComponentLink39URL: https://datasheet.octopart.com:443/ERA2AEB103X-Panasonic-datasheet-10050158.pdf?src-supplier=Arrow+Electronics; ComponentLink39Description: https://datasheet.octopart.com:443/ERA2AEB103X-Panasonic-datasheet-10050158.pdf?src-supplier=Arrow+Electronics; ComponentLink40URL: https://datasheet.octopart.com:443/ERA-2AEB103X-Panasonic-datasheet-33006989.pdf?src-supplier=Electro+Sonic; ComponentLink40Description: https://datasheet.octopart.com:443/ERA-2AEB103X-Panasonic-datasheet-33006989.pdf?src-supplier=Electro+Sonic
R27 = CMP-03412-037823-1: RES SMD 0 OHM JUMPER 1/8W 0805; Voltage Rating: 150V; Temperature Coefficient: 200ppm/°C; Tolerance: 5%; Max Power Dissipation: 125mW; Resistance: 0R; Number of Terminations: 2; Width: 1.25mm; Case/Package: 0805; Min Operating Temperature: -55°C; Case Code (Imperial): 0805; Height: 0.024inch; Resistor Type: Thick Film; Features: Moisture Resistant; Power Rating: 125mW; Length: 0.079inch; Lead Free: Lead Free; Series: AC; Packaging: Tape and Reel; Termination: SMD/SMT; Max Operating Temperature: 155°C; Case Code (Metric): 2012
U1 = STM32F765ZIT7: Integrated Circuit; Manufacturer_Name: STMicroelectronics; Datasheet Link: https://www.st.com/resource/en/datasheet/stm32f765bi.pdf; Height: 1.6mm; Manufacturer_Part_Number: STM32F765ZIT7; Mouser Part Number: 511-STM32F765ZIT7; Mouser Price/Stock: https://www.mouser.co.uk/ProductDetail/STMicroelectronics/STM32F765ZIT7?qs=lYGu3FyN48df6bb2YhdYOw%3D%3D; Arrow Part Number: STM32F765ZIT7; Arrow Price/Stock: https://www.arrow.com/en/products/stm32f765zit7/stmicroelectronics?utm_currency=USD&region=nac
X1 = CMP-062-000000-2: Description; Manufacturer_Name: Microchip; Manufacturer_Part_Number: DSA6101JL2B-032K768VAO; Source: DSA6101JL2B-032K768VAO.SchLib; Design Item ID: DSA6101JL2B-032K768VAO; Type: Oscillators; Copyright: Copyright (C) 2025 Ultra Librarian. All rights reserved.; RefDes: RefDes